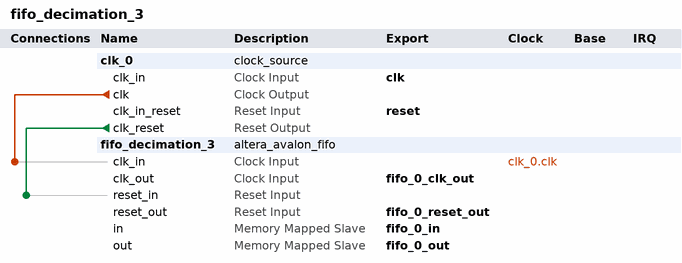
[diagram p0: system contents]
# Platform Designer (Qsys) system fifo_decimation_3, Cyclone V 5CGXFC5C6F27C7
# Parameters at their usual value, and those the tool derives, are not listed.
package require -exact qsys 17.0
create_system fifo_decimation_3
set_project_property DEVICE_FAMILY {Cyclone V}
set_project_property DEVICE 5CGXFC5C6F27C7

add_instance clk_0 clock_source 17.0
set_instance_parameter_value clk_0 clockFrequency 50000000

add_instance fifo_decimation_3 altera_avalon_fifo 17.0
set_instance_parameter_value fifo_decimation_3 bitsPerSymbol 16
set_instance_parameter_value fifo_decimation_3 channelWidth 8
set_instance_parameter_value fifo_decimation_3 errorWidth 8
set_instance_parameter_value fifo_decimation_3 fifoDepth 16
set_instance_parameter_value fifo_decimation_3 fifoInputInterfaceOptions AVALONMM_WRITE
set_instance_parameter_value fifo_decimation_3 fifoOutputInterfaceOptions AVALONMM_READ
set_instance_parameter_value fifo_decimation_3 singleClockMode false
set_instance_parameter_value fifo_decimation_3 symbolsPerBeat 2
set_instance_parameter_value fifo_decimation_3 useIRQ true
set_instance_parameter_value fifo_decimation_3 usePacket true
set_instance_parameter_value fifo_decimation_3 useReadControl false
set_instance_parameter_value fifo_decimation_3 useWriteControl false

# connections
add_connection clk_0.clk fifo_decimation_3.clk_in clock
add_connection clk_0.clk_reset fifo_decimation_3.reset_in reset

# exported interfaces
add_interface clk clock sink
set_interface_property clk EXPORT_OF clk_0.clk_in
add_interface fifo_0_clk_out clock sink
set_interface_property fifo_0_clk_out EXPORT_OF fifo_decimation_3.clk_out
add_interface fifo_0_in avalon slave
set_interface_property fifo_0_in EXPORT_OF fifo_decimation_3.in
add_interface fifo_0_out avalon slave
set_interface_property fifo_0_out EXPORT_OF fifo_decimation_3.out
add_interface fifo_0_reset_out reset sink
set_interface_property fifo_0_reset_out EXPORT_OF fifo_decimation_3.reset_out
add_interface reset reset sink
set_interface_property reset EXPORT_OF clk_0.clk_in_reset

set_interconnect_requirement {$system} qsys_mm.clockCrossingAdapter HANDSHAKE
set_interconnect_requirement {$system} qsys_mm.enableEccProtection FALSE
set_interconnect_requirement {$system} qsys_mm.insertDefaultSlave FALSE
set_interconnect_requirement {$system} qsys_mm.maxAdditionalLatency 1

save_system fifo_decimation_3.qsys
